# EAGLE design IC 555 new (EAGLE 9.6.2)
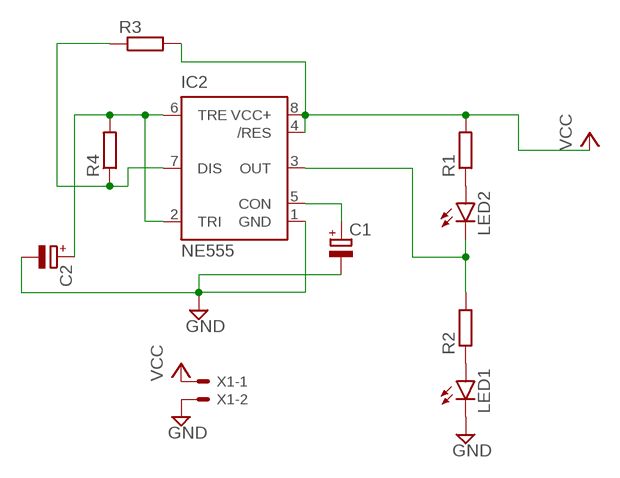
[diagram p0: schematic, sheet 1]

## Parts
C1  CPOL-EUE2.5-6  [E2,5-6]
C2  CPOL-EUE2.5-6  [E2,5-6]
IC2  NE555  [DIL-08]
LED1  LED5MM  [LED5MM]
LED2  LED5MM  [LED5MM]
R1  R-EU_0204/5  [0204/5]
R2  R-EU_0204/5  [0204/5]
R3  R-EU_0204/5  [0204/5]
R4  R-EU_0204/5  [0204/5]
X1  JST-XH-02-PIN-ROUND-PAD  [JST-XH-02-PACKAGE-ROUND-PAD]

## Nets
GND: C1.- C2.- IC2.1(GND) LED1.K(C) X1.2
N$1: LED1.A R2.1
N$2: C2.+ IC2.2(TRI) IC2.6(TRE) R4.2
N$3: IC2.7(DIS) R3.1 R4.1
N$4: C1.+ IC2.5(CON)
N$5: LED2.A R1.1
N$6: IC2.3(OUT) LED2.K(C) R2.2
VCC: IC2.4(/RES) IC2.8(VCC+) R1.2 R3.2 X1.1

## Library data of the parts
C1 C2 = rcl:CPOL-EU: POLARIZED CAPACITOR, European symbol; SPICEPREFIX: C
IC2 = st-microelectronics:NE555: General purpose bipolar Timer; MF: Arrow Electronics; MPN: NE555N; OC_FARNELL: 1467742; OC_NEWARK: 89K1486
LED1 LED2 = led:LED: LED OSRAM: - CHIPLED LG R971, LG N971, LY N971, LG Q971, LY Q971, LO R971, LY R971 LH N974, LH R974 LS Q976, LO Q976, LY Q976 LO Q996 - Hyper CHIPLED LW Q18S LB Q993, LB Q99A, LB R99A - SideLED LS A670, LO A670, LY A670, LG A670, LP A670 LB A673, LV A673, LT A673, LW A673 LH A674 LY A675 LS A676, LA A676, LO A676, LY A676, LW A676 LS A679, LY A679, LG A679 - Hyper Micro SIDELED® LS Y876, LA Y876, LO Y876, LY Y876 LT Y87S - SmartLED LW L88C, LW L88S LB L89C, LB L89S, LG L890 LS L89K, LO L89K, LY L89K LS L896, LA L896, LO L896, LY L896 - TOPLED LS T670, LO T670, LY T670, LG T670, LP T670 LSG T670, LSP T670, LSY T670, LOP T670, LYG T670 LG T671, LOG T671, LSG T671 LB T673, LV T673, LT T673, LW T673 LH T674 LS T676, LA T676, LO T676, LY T676, LB T676, LH T676, LSB T676, LW T676 LB T67C, LV T67C, LT T67C, LS T67K, LO T67K, LY T67K, LW E67C LS E67B, LA E67B, LO E67B, LY E67B, LB E67C, LV E67C, LT E67C LW T67C LS T679, LY T679, LG T679 LS T770, LO T770, LY T770, LG T770, LP T770 LB T773, LV T773, LT T773, LW T773 LH T774 LS E675, LA E675, LY E675, LS T675 LS T776, LA T776, LO T776, LY T776, LB T776 LHGB T686 LT T68C, LB T68C - Hyper Mini TOPLED® LB M676 - Mini TOPLED Santana® LG M470 LS M47K, LO M47K, LY M47K Source: http://www.osram.convergy.de LUXEON: - LUMILED® LXK2-PW12-R00, LXK2-PW12-S00, LXK2-PW14-U00, LXK2-PW14-V00 LXK2-PM12-R00, LXK2-PM12-S00, LXK2-PM14-U00 LXK2-PE12-Q00, LXK2-PE12-R00, LXK2-PE12-S00, LXK2-PE14-T00, LXK2-PE14-U00 LXK2-PB12-K00, LXK2-PB12-L00, LXK2-PB12-M00, LXK2-PB14-N00, LXK2-PB14-P00, LXK2-PB14-Q00 LXK2-PR12-L00, LXK2-PR12-M00, LXK2-PR14-Q00, LXK2-PR14-R00 LXK2-PD12-Q00, LXK2-PD12-R00, LXK2-PD12-S00 LXK2-PH12-R00, LXK2-PH12-S00 LXK2-PL12-P00, LXK2-PL12-Q00, LXK2-PL12-R00 Source: www.luxeon.com KINGBRIGHT: KA-3528ASYC Source: www.kingbright.com
R1-R4 = rcl:R-EU_: RESISTOR, European symbol; SPICEPREFIX: R
X1 = Rembrandt Electronics - JST XH Connectors v1-0:JST-XH-02-PIN: JST XH Connector 2 Pin Wire to board connector. Pitch: 2,54 mm, (0.100") Number of pins: 2 Created by Rembrandt Electronics www.rembrandtelectronics.com

## Board
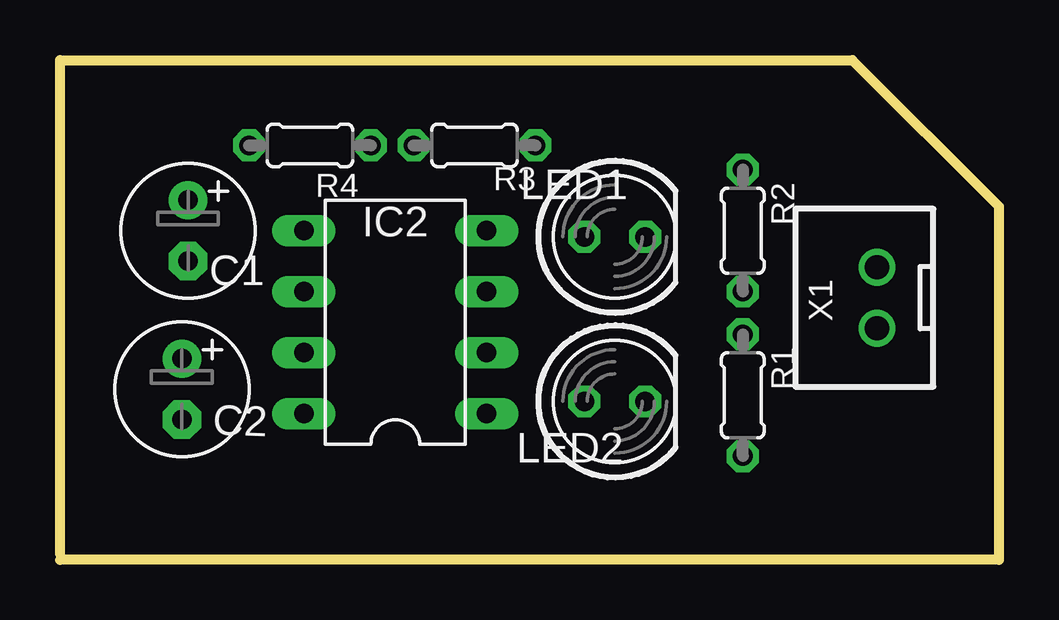
[diagram p1: board, top side]
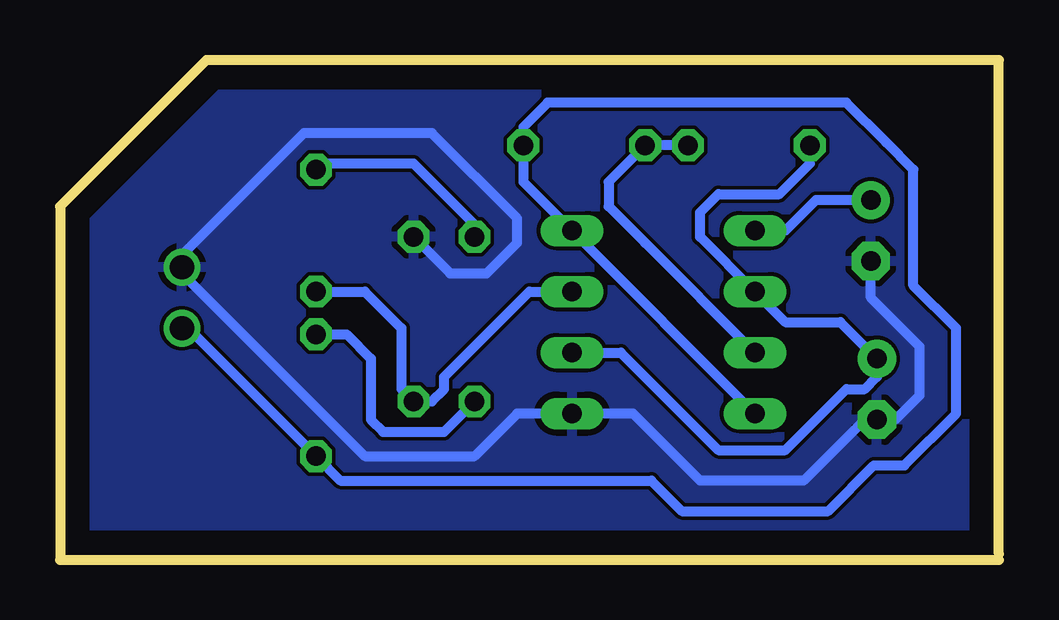
[diagram p2: board, bottom side, seen from below]

Size 39.12 x 20.83 mm. Coordinates in mm from the lower left corner, seen from the top.
Outline: 0,0 39.12,0 39.12,14.73 33.02,20.83 0,20.83 0,0.25
Copper layers (1*16): Top 0.035mm / dielectric 1.5mm / Bottom 0.035mm
Design rules "default": minimum track width 6mil, minimum drill 0.35mm, track to track 6mil, track to pad 6mil, pad to pad 6mil, via to via 6mil, smd to smd 6mil, copper to edge 40mil, drill to drill 6mil, minimum pad ring 10mil, minimum via ring 8mil, stop-mask expansion 4mil, vias tented up to drill 0mil, thermal gap 10mil

### Footprints (pad centres in the part's own frame; a part is rotated, then mirrored left to right if it is on the bottom)
E2,5-6 = drill 0.813 pad 1.6: + -1.27,0 | drill 0.813 pad 1.6 octagon: - 1.27,0
DIL-08 = drill 0.813 long: 1 -3.81,-3.81; 2 -1.27,-3.81; 3 1.27,-3.81; 4 3.81,-3.81; 5 3.81,3.81; 6 1.27,3.81; 7 -1.27,3.81; 8 -3.81,3.81
LED5MM = drill 0.813 octagon: A -1.27,0; K 1.27,0
0204/5 = drill 0.813 octagon: 1 -2.54,0; 2 2.54,0
JST-XH-02-PACKAGE-ROUND-PAD = drill 1.016: 1 -1.27,0; 2 1.27,0

### Placement (x,y rotation side)
C1  5.33,13.72 270 top
C2  5.08,7.11 270 top
IC2  13.97,9.91 90 top
LED1  23.11,13.46 0 top
LED2  23.11,6.6 0 top
R1  28.45,6.86 270 top
R2  28.45,13.72 270 top
R3  17.27,17.27 0 top
R4  10.41,17.27 180 top
X1  34.04,10.92 90 top

### Tracks (layer width: path | path; a pad name or v marks a point on that pad's centre or on a via)
GND
  Bottom 0.406: C1.- 5.33,10.92 3.3,8.89 3.3,6.86 4.32,5.84 C2.- 5.59,5.84 8.13,3.3 12.45,3.3 15.24,6.1 IC2.1 20.07,6.1 21.84,4.32 26.42,4.32 34.04,11.94 X1.2 34.04,12.7 28.96,17.78 23.62,17.78 20.07,14.22 20.07,13.21 21.34,11.94 22.86,11.94 LED1.K
  pour Bottom (isolate 2.54): 0,20.83 33.02,20.83 39.12,14.73 39.12,0.25 39.12,0 0,0
  pour Bottom (rank 5): 0,20.83 33.02,20.83 39.12,14.73 39.12,0 0,0
N$1
  Bottom 0.406: LED1.A 21.84,13.97 24.38,16.51 28.19,16.51 R2.1
N$2
  Bottom 0.406: IC2.2 15.75,8.64 11.68,4.57 8.89,4.57 6.35,7.11 5.59,7.11 5.08,7.62 C2.+ 6.6,9.91 8.89,9.91 IC2.6 | 9.91,10.92 IC2.6 | R4.2 7.87,16.51 9.14,15.24 11.68,15.24 12.45,14.48 12.45,13.46 IC2.6
N$3
  Bottom 0.406: IC2.7 14.73,13.21 16.26,14.73 16.26,15.75 R3.1 R4.1
N$4
  Bottom 0.406: C1.+ 7.62,14.99 8.89,13.72 IC2.5
N$5
  Bottom 0.406: R1.1 27.18,9.4 26.16,8.38 26.16,5.84 25.65,5.33 23.11,5.33 LED2.A
N$6
  Bottom 0.406: R2.2 26.42,11.18 24.89,9.65 24.89,7.11 LED2.K 23.62,6.6 23.11,7.11 23.11,7.62 19.56,11.18 IC2.3
VCC
  Bottom 0.406: IC2.8 IC2.4 19.81,15.75 R3.2 19.81,18.03 18.8,19.05 6.35,19.05 4.7,17.4 3.56,16.26 3.56,11.43 1.78,9.65 1.78,6.1 3.94,3.94 5.21,3.94 7.11,2.03 13.21,2.03 14.48,3.3 27.43,3.3 R1.2 33.78,9.65 X1.1